# EasyEDA Pro project ProPrj_MOSSE_2026-03-25.epro, schematic Schematic1

## Sheets
1 P1: Board Name: Board1; Create Date: 2026-03-12; Page Name: P1; Project Name: MOSSE; Schematic Name: Schematic1; Update Date: 2026-03-15; Company: EasyEDA.com; Page Size: A4; Version: V1.0
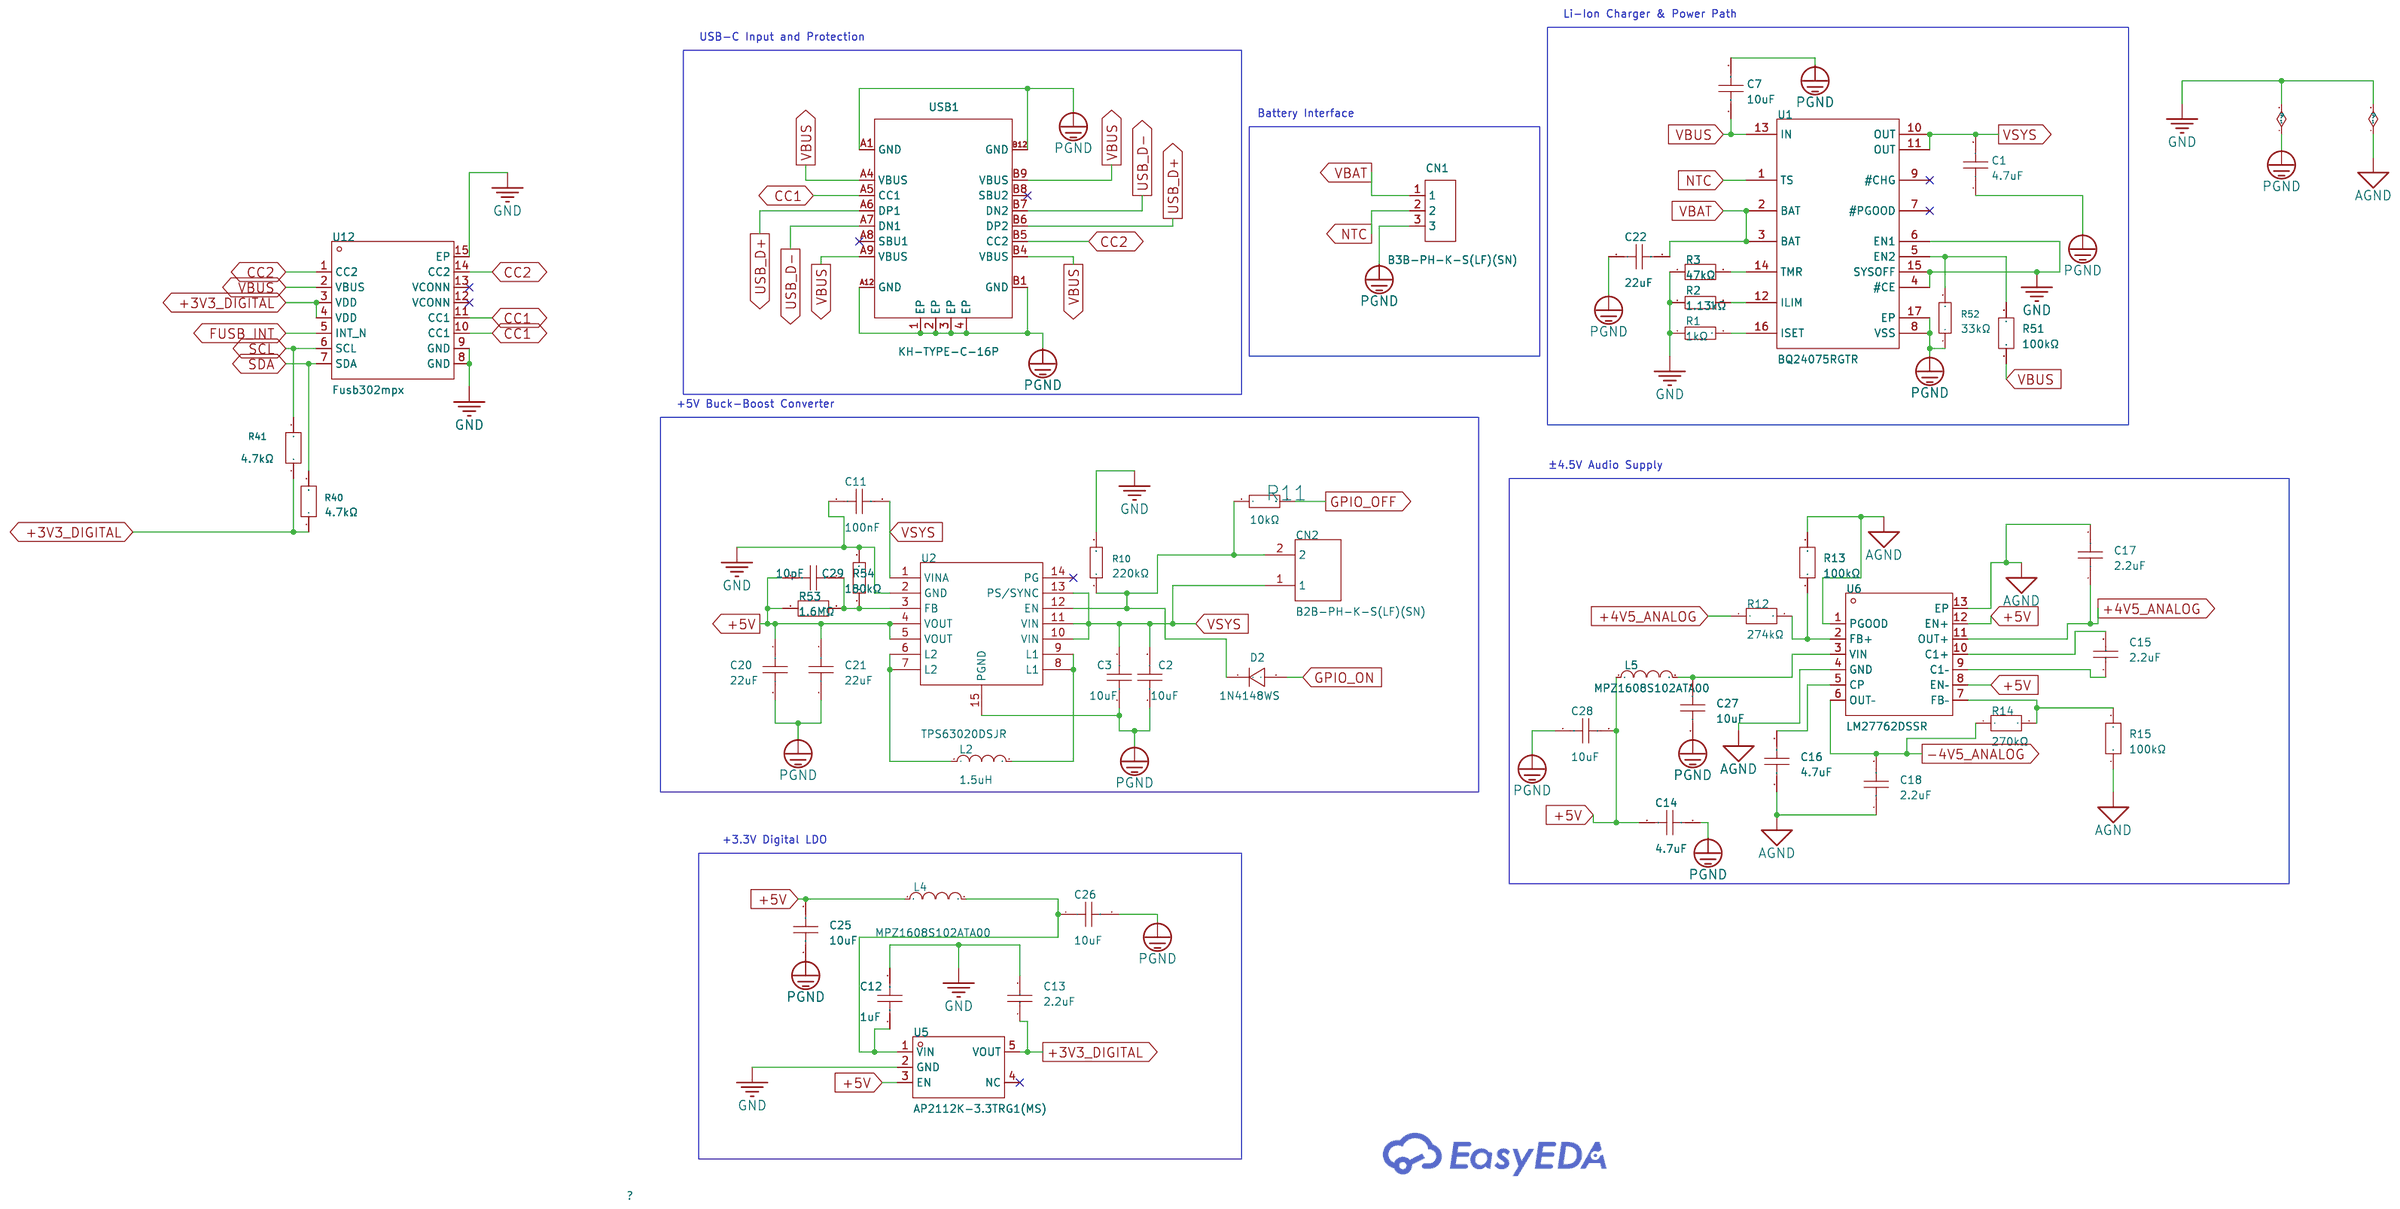
[diagram p0: P1]
2 P3: Create Date: 2026-03-13; Page Name: P3; Update Date: 2026-03-13
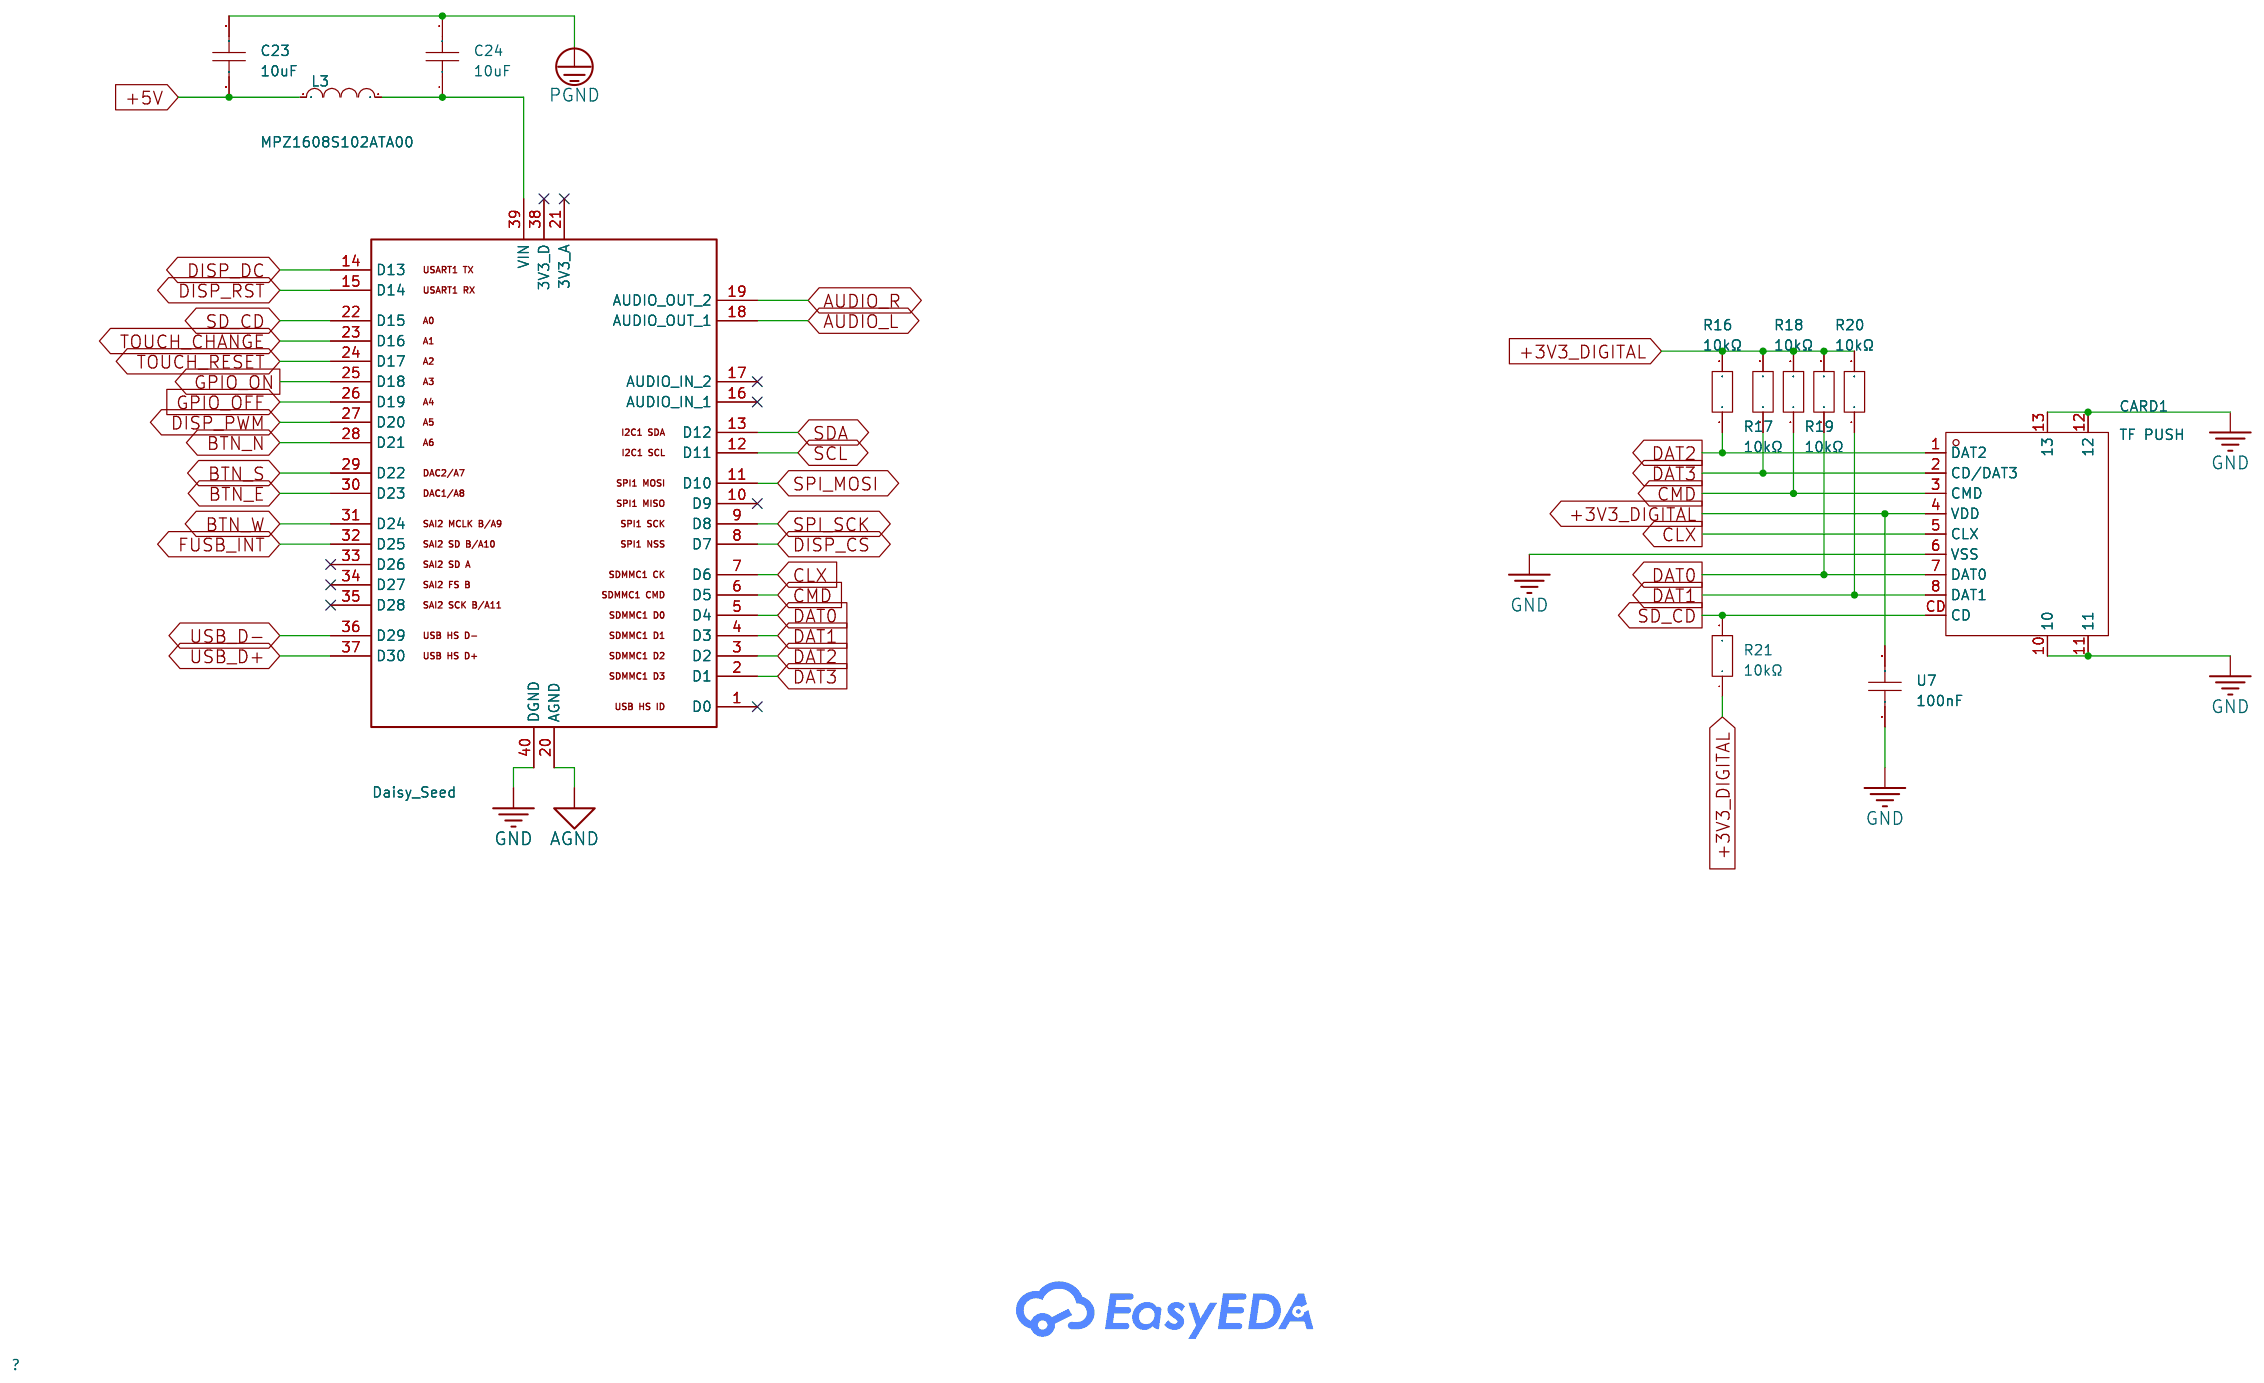
[diagram p1: P3]
3 P4: Create Date: 2026-03-15; Page Name: P4; Update Date: 2026-03-14
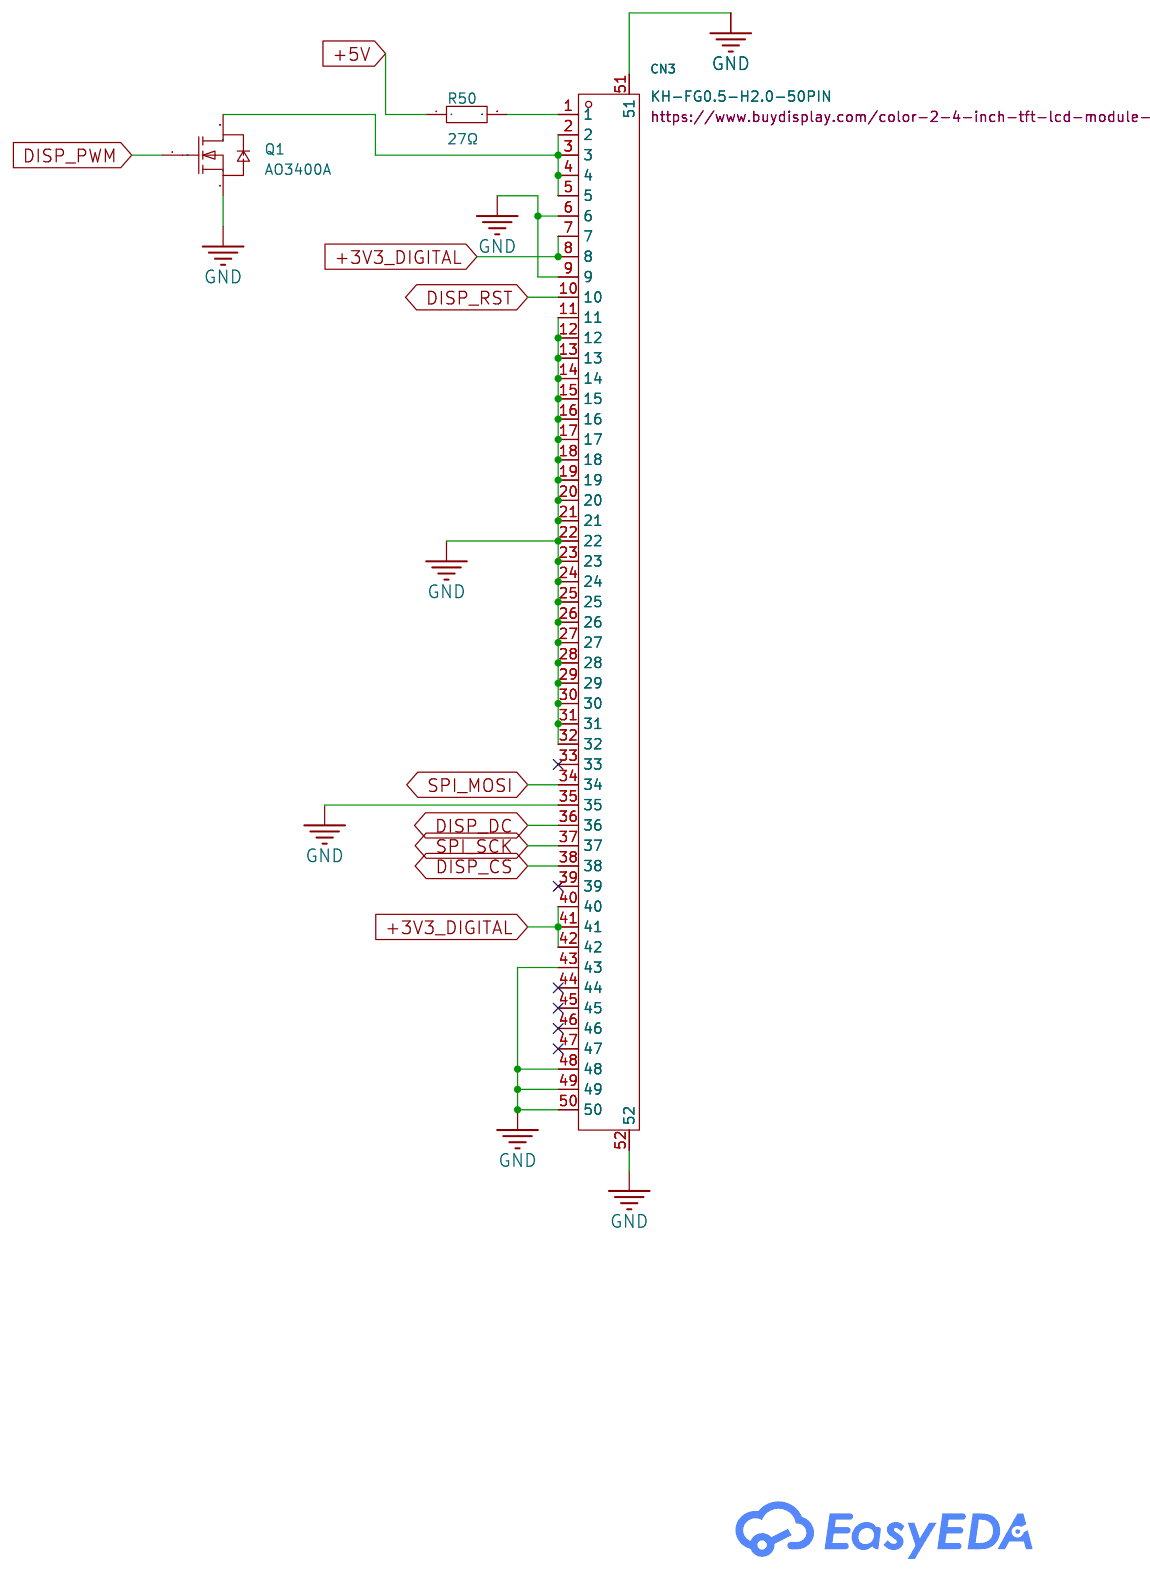
[diagram p2: P4]
4 P5: Create Date: 2026-03-15; Page Name: P5
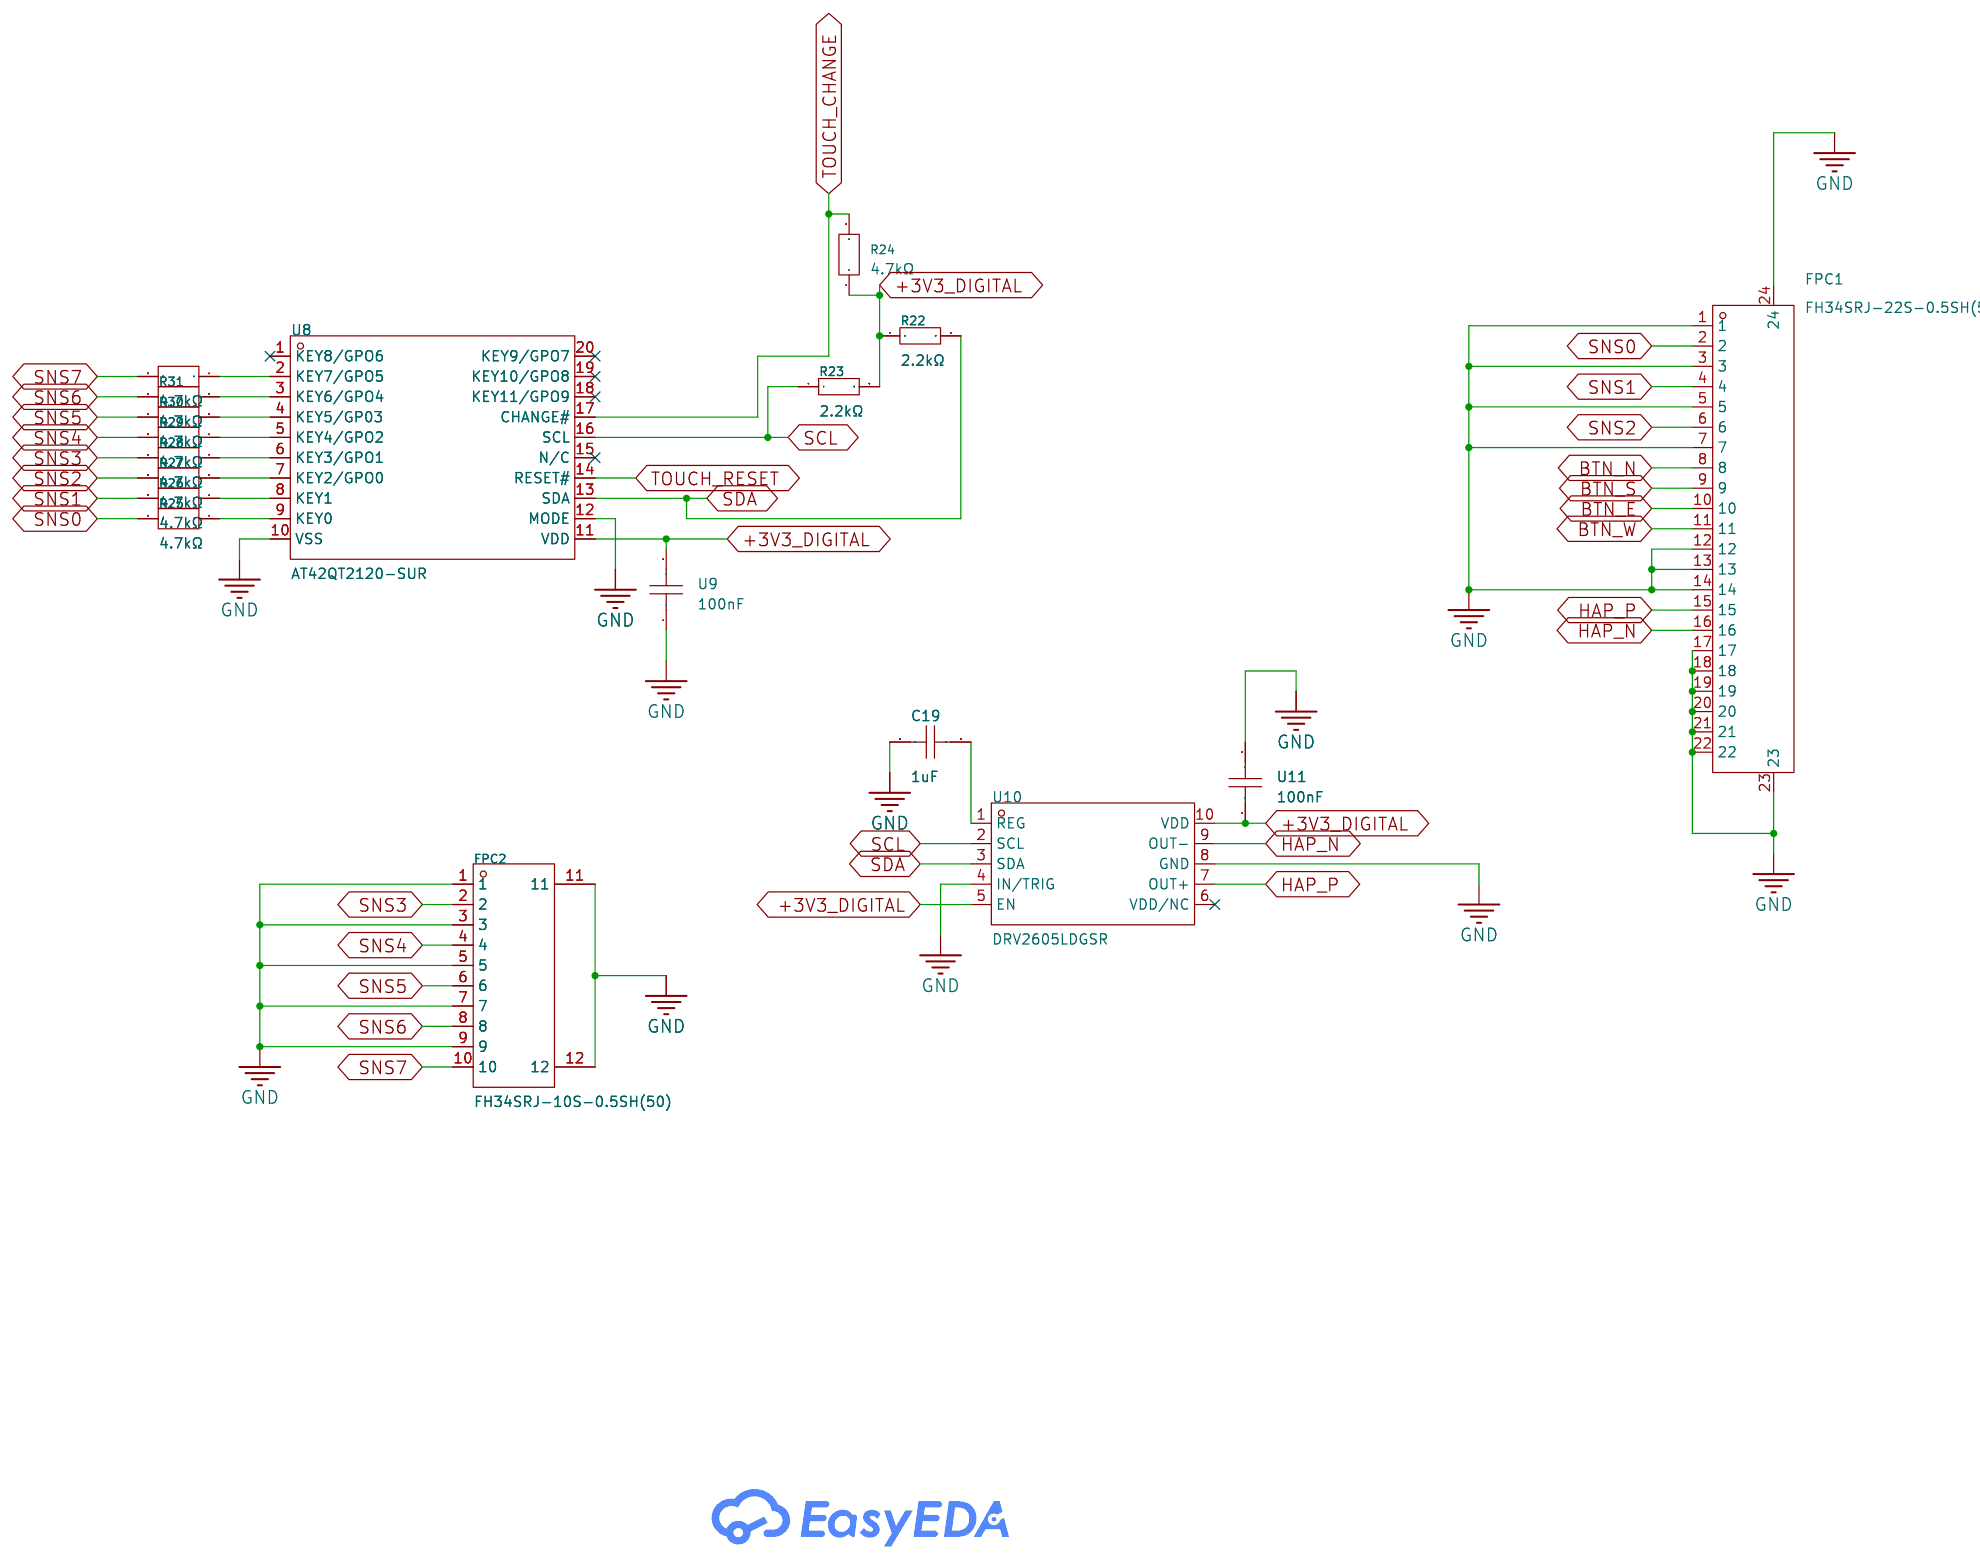
[diagram p3: P5]
5 P6: Create Date: 2026-03-15; Page Name: P6
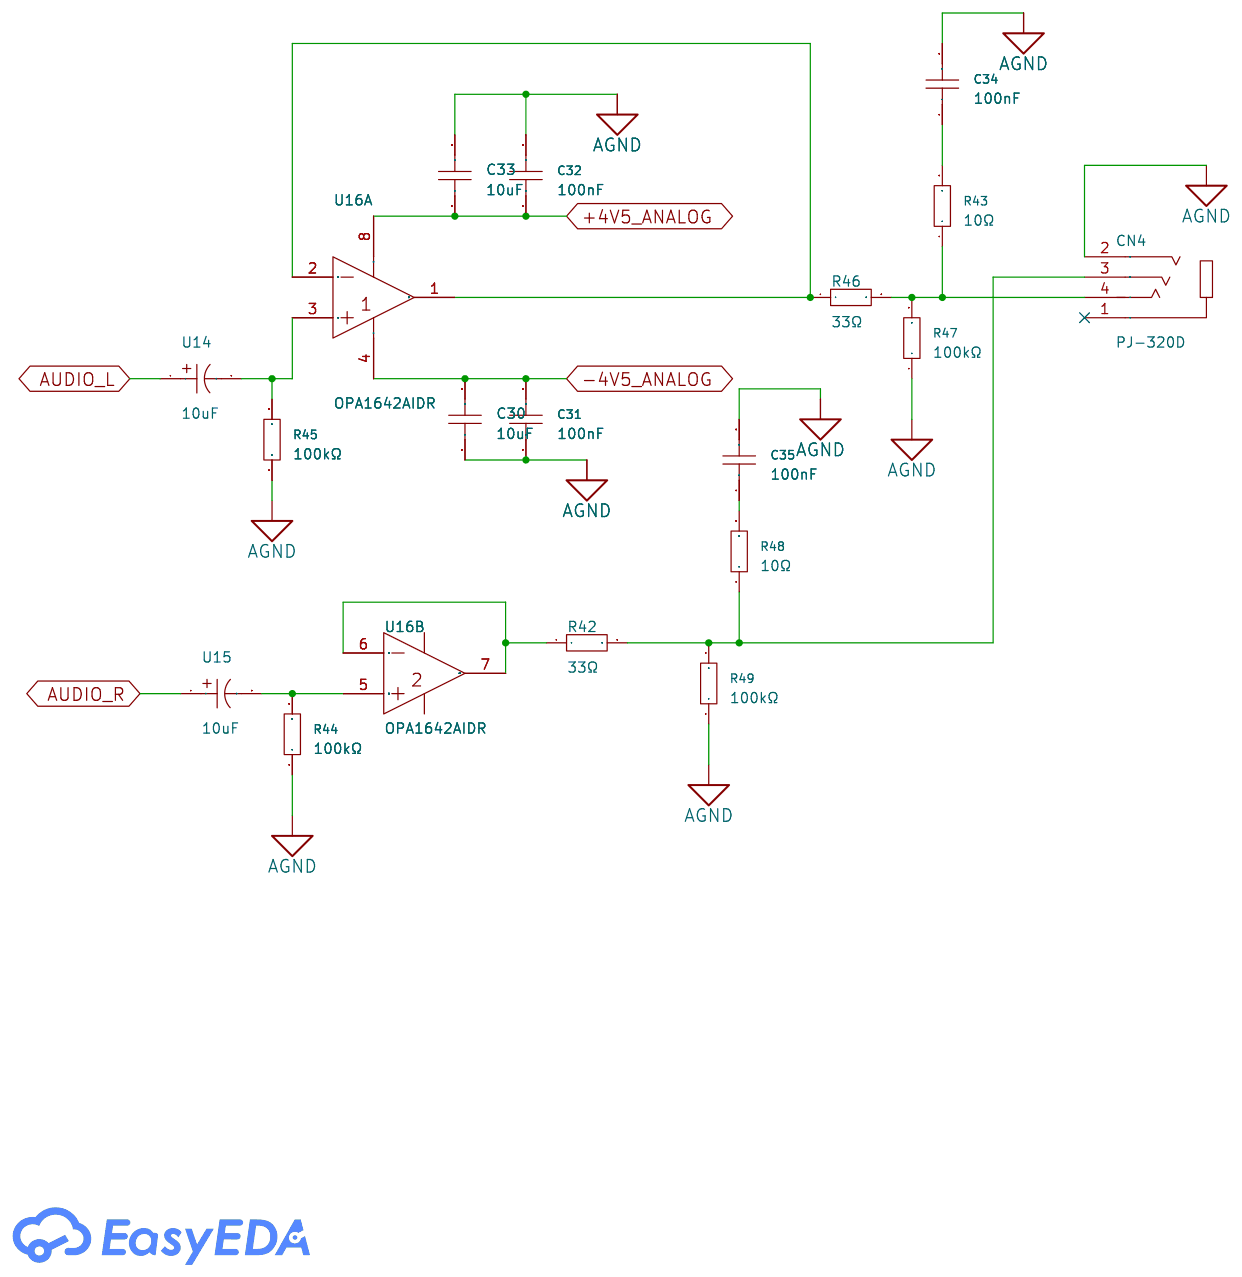
[diagram p4: P6]

## Parts
sheet P1
C1  4.7uF  [C0603]
C2  10uF  [C0603]
C3  10uF  [C0603]
C7  10uF  [C0603]
C11  100nF  [C0603]
C12  1uF  [C0603]
C13  2.2uF  [C0603]
C14  4.7uF  [C0603]
C15  2.2uF  [C0603]
C16  4.7uF  [C0603]
C17  2.2uF  [C0603]
C18  2.2uF  [C0603]
C20  22uF  [C0805]
C21  22uF  [C0805]
C22  22uF  [C0805]
C25  10uF  [C0805]
C26  10uF  [C0805]
C27  10uF  [C0805]
C28  10uF  [C0805]
C29  10pF  [C0603]
CN1  B3B-PH-K-S(LF)(SN)  [CONN-TH_B3B-PH-K-S]
CN2  B2B-PH-K-S(LF)(SN)  [CONN-TH_B2B-PH-K-S]
D2  1N4148WS  [SOD-323_L1.8-W1.3-LS2.5-RD]
L2  1.5uH  [IND-SMD_CYA1040-100UH]
L4  MPZ1608S102ATA00  [L0603]
L5  MPZ1608S102ATA00  [L0603]
R1  1kΩ  [R0603]
R2  1.13kΩ  [R0603]
R3  47kΩ  [R0603]
R10  220kΩ  [R0603]
R11  10kΩ  [R0603]
R12  274kΩ  [R0603]
R13  100kΩ  [R0603]
R14  270kΩ  [R0603]
R15  100kΩ  [R0603]
R40  4.7kΩ  [R0603]
R41  4.7kΩ  [R0603]
R51  100kΩ  [R0805]
R52  33kΩ  [R0805]
R53  1.6MΩ  [R0603]
R54  180kΩ  [R0603]
U1  BQ24075RGTR  [QFN-16_L3.0-W3.0-P0.50-TL-EP1.7]
U2  TPS63020DSJR  [VSON-14_L4.0-W3.0-P0.50-BL-EP_TI_DSJ]
U5  AP2112K-3.3TRG1(MS)  [SOT-23-5_L2.9-W1.6-P0.95-LS2.7-BR]
U6  LM27762DSSR  [WSON-12_L3.0-W2.0-P0.50-BL-EP]
U12  Fusb302mpx  [MLP-14_L2.5-W2.5-P0.50-BL-EP]
USB1  KH-TYPE-C-16P  [USB-C-SMD_KH-TYPE-C-16P]
sheet P3
C23  10uF  [C0805]
C24  10uF  [C0805]
CARD1  TF PUSH  [TF-SMD_TF-PUSH]
L3  MPZ1608S102ATA00  [L0603]
R16  10kΩ  [R0603]
R17  10kΩ  [R0603]
R18  10kΩ  [R0603]
R19  10kΩ  [R0603]
R20  10kΩ  [R0603]
R21  10kΩ  [R0603]
U4  Daisy_Seed  [Daisy_Seed]
U7  100nF  [C0603]
sheet P4
CN3  KH-FG0.5-H2.0-50PIN  [FPC-SMD_KH-FG0.5-H2.0-50PIN]
Q1  AO3400A  [SOT-23-3_L3.0-W1.6-P1.90-LS2.8-BR]
R50  27Ω  [R0805]
sheet P5
C19  1uF  [C0603]
FPC1  FH34SRJ-22S-0.5SH(50)  [FFC-SMD_22P-P0.50_HRS_FH34SRJ-22S-0.5SH]
FPC2  FH34SRJ-10S-0.5SH(50)  [FFC-SMD_10P-P0.50_FH34SRJ-10S-0.5SH]
R22  2.2kΩ  [R0402]
R23  2.2kΩ  [R0402]
R24  4.7kΩ  [R0603]
R25  4.7kΩ  [R0603]
R26  4.7kΩ  [R0603]
R27  4.7kΩ  [R0603]
R28  4.7kΩ  [R0603]
R29  4.7kΩ  [R0603]
R30  4.7kΩ  [R0603]
R31  4.7kΩ  [R0603]
R32  4.7kΩ  [R0603]
U8  AT42QT2120-SUR  [SOIC-20_L12.8-W7.5-P1.27-LS10.3-BL]
U9  100nF  [C0603]
U10  DRV2605LDGSR  [VSSOP-10_L3.0-W3.0-P0.50-LS4.9-BL]
U11  100nF  [C0603]
sheet P6
C30  10uF  [C0805]
C31  100nF  [C0603]
C32  100nF  [C0603]
C33  10uF  [C0805]
C34  100nF  [C0603]
C35  100nF  [C0603]
CN4  PJ-320D  [AUDIO-SMD_PJ-320D-1]
R42  33Ω  [R0603]
R43  10Ω  [R0603]
R44  100kΩ  [R0603]
R45  100kΩ  [R0603]
R46  33Ω  [R0603]
R47  100kΩ  [R0603]
R48  10Ω  [R0603]
R49  100kΩ  [R0603]
U14  10uF  [CAP-SMD_BD4.0-L4.3-W4.3-LS5.0-FD]
U15  10uF  [CAP-SMD_BD4.0-L4.3-W4.3-LS5.0-FD]
U16  OPA1642AIDR  [SOIC-8_L4.9-W3.9-P1.27-LS6.0-BL]  (sections 1,2)

## Library data of the parts
C1 = TCC0603X7R475K160CT: Capacitance:4.7uF Tolerance:±10% Tolerance:±10% Voltage Rating:16V; LCSC Part Name: 4.7uF ±10% 16V; Supplier Part: C48543608; Manufacturer: CCTC(三环); Supplier Footprint: 0603; JLCPCB Part Class: Extended Part; Datasheet: https://item.szlcsc.com/datasheet/TCC0603X7R475K160CT/50806376.html; Supplier: LCSC; Tolerance: ±10%; Voltage Rating: 16V
C2 C3 C7 = 0603X106K100CT: Capacitance:10uF Tolerance:±10% Tolerance:±10% Voltage Rating:- Temperature Coefficient:X5R; LCSC Part Name: 10uF ±10%; Supplier Part: C2840513; Manufacturer: Walsin(华新科); Supplier Footprint: 0603; JLCPCB Part Class: Extended Part; Datasheet: https://item.szlcsc.com/datasheet/0603X106K100CT/3019312.html; Supplier: LCSC; Tolerance: ±10%; Temperature Coefficient: X5R
C11 = CC0603KRX7R9BB104: Capacitance:100nF Tolerance:±10% Tolerance:±10% Voltage Rating:50V Temperature Coefficient:X7R; LCSC Part Name: 100nF ±10% 50V; Supplier Part: C14663; Manufacturer: YAGEO(国巨); Supplier Footprint: 0603; JLCPCB Part Class: Basic Part; Datasheet: https://item.szlcsc.com/datasheet/CC0603KRX7R9BB104/15331.html; Supplier: LCSC; Tolerance: ±10%; Voltage Rating: 50V; Temperature Coefficient: X7R
C12 = CL10A105KB8NNNC: Capacitance:1uF Tolerance:±10% Tolerance:±10% Voltage Rating:50V Temperature Coefficient:X5R; LCSC Part Name: 1uF ±10% 50V; Supplier Part: C15849; Manufacturer: SAMSUNG(三星); Supplier Footprint: 0603; JLCPCB Part Class: Basic Part; Datasheet: https://item.szlcsc.com/datasheet/CL10A105KB8NNNC/16531.html; Supplier: LCSC; Tolerance: ±10%; Voltage Rating: 50V; Temperature Coefficient: X5R
C13 C15 = CL10A225KO8NNNC: Capacitance:2.2uF Tolerance:±10% Tolerance:±10% Voltage Rating:16V Temperature Coefficient:X5R; LCSC Part Name: 2.2uF ±10% 16V; Supplier Part: C23630; Manufacturer: SAMSUNG(三星); Supplier Footprint: 0603; JLCPCB Part Class: Basic Part; Datasheet: https://item.szlcsc.com/datasheet/CL10A225KO8NNNC/24366.html; Supplier: LCSC; Tolerance: ±10%; Voltage Rating: 16V; Temperature Coefficient: X5R
C14 C16 = V475K0603X5R160NDT: Capacitance:4.7uF Voltage Rating:16V Temperature Coefficient:X5R; LCSC Part Name: 4.7uF 16V; Supplier Part: C2980396; Manufacturer: VIIYONG(微容); Supplier Footprint: 0603; JLCPCB Part Class: Extended Part; Datasheet: https://item.szlcsc.com/datasheet/V475K0603X5R160NDT/3402085.html; Supplier: LCSC; Voltage Rating: 16V; Temperature Coefficient: X5R
C17 C18 = 0603X225M160NT: Capacitance:2.2uF Tolerance:±20% Tolerance:±20% Voltage Rating:16V; LCSC Part Name: 2.2uF ±20% 16V; Supplier Part: C50331154; Manufacturer: FH(风华); Supplier Footprint: 0603; JLCPCB Part Class: Extended Part; Datasheet: https://item.szlcsc.com/datasheet/0603X225M160NT/52930819.html; Supplier: LCSC; Tolerance: ±20%; Voltage Rating: 16V
C20-C22 = 0805X226M160NT: Capacitance:22uF Tolerance:±20% Tolerance:±20% Voltage Rating:16V Temperature Coefficient:X5R; LCSC Part Name: 22uF ±20% 16V; Supplier Part: C129302; Manufacturer: FH(风华); Supplier Footprint: 0805; JLCPCB Part Class: Extended Part; Datasheet: https://item.szlcsc.com/datasheet/0805X226M160NT/140588.html; Supplier: LCSC; Tolerance: ±20%; Voltage Rating: 16V; Temperature Coefficient: X5R
C23-C28 C30 C33 = 0805B106K160NT: Capacitance:10uF Tolerance:±10% Tolerance:±10% Voltage Rating:16V Temperature Coefficient:X7R; LCSC Part Name: 10uF ±10% 16V; Supplier Part: C92341; Manufacturer: FH(风华); Supplier Footprint: 0805; JLCPCB Part Class: Extended Part; Datasheet: https://item.szlcsc.com/datasheet/0805B106K160NT/93534.html; Supplier: LCSC; Tolerance: ±10%; Voltage Rating: 16V; Temperature Coefficient: X7R
C29 = 0603N100D500CT: Capacitance:10pF Voltage Rating:50V Temperature Coefficient:NP0; LCSC Part Name: ±0.5pF 10pF 50V; Supplier Part: C296044; Manufacturer: Walsin(华新科); Supplier Footprint: 0603; JLCPCB Part Class: Extended Part; Datasheet: https://item.szlcsc.com/datasheet/0603N100D500CT/280464.html; Supplier: LCSC; Voltage Rating: 50V; Temperature Coefficient: NP0
CN1 = B3B-PH-K-S(LF)(SN): Pins Structure:1x3P Pitch:2mm Mounting Type:Through Hole Reference Series:PH Number of Pins:3P Number of Rows:1 Number of PINs Per Row:3 Row Spacing:- Current Rating:2A Contact Material:Brass Contact Plating:Tin Operating Temperature:-25℃~+85℃ Operating T; LCSC Part Name: 1x3P 间距:2mm 直插 系列:PH; Supplier Part: C131339; Manufacturer: JST; Supplier Footprint: 插件,P=2mm; JLCPCB Part Class: Extended Part; Datasheet: https://item.szlcsc.com/datasheet/B3B-PH-K-S(LF)(SN)/142632.html; Supplier: LCSC; Pins Structure: 1x3P; Pitch: 2mm; Mounting Type: Through Hole; Reference Series: PH; Number of Pins: 3P; Number of Rows: 1; Number of PINs Per Row: 3; Current Rating: 2A; Contact Material: Brass; Contact Plating: Tin; Operating Temperature: -25℃~+85℃; Voltage Rating: 100V; Plastic Material: PA66; Flame Retardant Rating: UL94V-0; Supplementary Features: K Pin; Color: White; Z-Height of the Board: 6mm; X-Length of Bottom Edge on Board (Spacing Line): 7.9mm; Y-Width of Bottom Edge on Board: 4.5mm
CN2 = B2B-PH-K-S(LF)(SN): Pins Structure:1x2P Pitch:2mm Mounting Type:Through Hole Reference Series:PH Number of Pins:2P Number of Rows:1 Number of PINs Per Row:2 Row Spacing:- Current Rating:2A Contact Material:Brass Contact Plating:Tin Operating Temperature:-25℃~+85℃ Operating T; LCSC Part Name: 1x2P 间距:2mm 直插 系列:PH; Supplier Part: C131337; Manufacturer: JST; Supplier Footprint: 插件,P=2mm; JLCPCB Part Class: Extended Part; Datasheet: https://item.szlcsc.com/datasheet/B2B-PH-K-S(LF)(SN)/142630.html; Supplier: LCSC; Pins Structure: 1x2P; Pitch: 2mm; Mounting Type: Through Hole; Reference Series: PH; Number of Pins: 2P; Number of Rows: 1; Number of PINs Per Row: 2; Current Rating: 2A; Contact Material: Brass; Contact Plating: Tin; Operating Temperature: -25℃~+85℃; Voltage Rating: 100V; Plastic Material: PA66; Flame Retardant Rating: UL94V-0; Supplementary Features: K Pin; Color: White; Z-Height of the Board: 6mm; X-Length of Bottom Edge on Board (Spacing Line): 5.9mm; Y-Width of Bottom Edge on Board: 4.5mm
D2 = 1N4148WS_C2128: Diode Configuration:Independent Voltage - Forward(Vf@If):1.25V@150mA Voltage - DC Reverse(Vr):100V Current - Rectified:150mA Pd - Power Dissipation:200mW Reverse Leakage Current (Ir):1uA@75V Reverse Recovery Time (trr):4ns Operating Junction Temperature R; LCSC Part Name: 丝印T4 1N4148WS; Supplier Part: C2128; Manufacturer: CJ(江苏长电/长晶); Supplier Footprint: SOD-323; JLCPCB Part Class: Basic Part; Datasheet: https://item.szlcsc.com/datasheet/1N4148WS/2485.html; Supplier: LCSC; Diode Configuration: Independent; Voltage - Forward(Vf@If): 1.25V@150mA; Voltage - DC Reverse(Vr): 100V; Current - Rectified: 150mA; Pd - Power Dissipation: 200mW; Reverse Leakage Current (Ir): 1uA@75V; Reverse Recovery Time (trr): 4ns; Non-Repetitive Peak Forward Surge Current: 2A
L2 = CYA1040-1.5UH: Inductance:1.5uH Tolerance:±20% Tolerance:±20% Current Rating:16A Current - Saturation (Isat):22A DC Resistance(DCR):3.8mΩ; LCSC Part Name: 1.5uH ±20% 22A; Supplier Part: C6364672; Manufacturer: SHOU HAN(首韩); Supplier Footprint: SMD,11.6x10.1mm; JLCPCB Part Class: Extended Part; Datasheet: https://item.szlcsc.com/datasheet/CYA1040-1.5UH/7314074.html; Supplier: LCSC; Tolerance: ±20%; Current Rating: 16A; Current - Saturation (Isat): 22A; DC Resistance(DCR): 3.8mΩ
L3-L5 = MPZ1608S102ATA00: Impedance @ Frequency:1kΩ@100MHz Tolerance:±25% Tolerance:±25% DC Resistance:300mΩ Current Rating:800mA Circuits:1; LCSC Part Name: 单路 0603磁珠 阻抗1kΩ@100MHz; Supplier Part: C76814; Manufacturer: TDK; Supplier Footprint: 0603; JLCPCB Part Class: Extended Part; Datasheet: https://atta.szlcsc.com/upload/public/pdf/source/20170420/1492670791787.pdf; Supplier: LCSC; Impedance @ Frequency: 1kΩ@100MHz; Tolerance: ±25%; DC Resistance: 300mΩ; Current Rating: 800mA; Circuits: 1
R1 = 0603WAF1001T5E: Type:Thick Film Resistor Resistance:1kΩ Tolerance:±1% Tolerance:±1% Power(Watts):100mW Voltage-Supply(Max):75V Temperature Coefficient:±100ppm/℃ Temperature Coefficient:±100ppm/℃ Operating Temperature:-55℃~+155℃ Operating Temperature:-55℃~+155℃; LCSC Part Name: 1kΩ ±1% 100mW 厚膜电阻; Supplier Part: C21190; Manufacturer: UNI-ROYAL(厚声); Supplier Footprint: 0603; JLCPCB Part Class: Basic Part; Datasheet: https://item.szlcsc.com/datasheet/0603WAF1001T5E/21904.html; Supplier: LCSC; Type: Thick Film Resistor; Tolerance: ±1%; Power(Watts): 100mW; Voltage-Supply(Max): 75V; Temperature Coefficient: ±100ppm/℃; Operating Temperature: -55℃~+155℃
R2 = 0603WAF1131T5E: Type:Thick Film Resistor Resistance:1.13kΩ Tolerance:±1% Tolerance:±1% Power(Watts):100mW Voltage-Supply(Max):75V Temperature Coefficient:±100ppm/℃ Temperature Coefficient:±100ppm/℃ Operating Temperature:-55℃~+155℃ Operating Temperature:-55℃~+155℃; LCSC Part Name: 1.13kΩ ±1% 100mW 厚膜电阻; Supplier Part: C22833; Manufacturer: UNI-ROYAL(厚声); Supplier Footprint: 0603; JLCPCB Part Class: Extended Part; Datasheet: https://item.szlcsc.com/datasheet/0603WAF1131T5E/23560.html; Supplier: LCSC; Type: Thick Film Resistor; Tolerance: ±1%; Power(Watts): 100mW; Voltage-Supply(Max): 75V; Temperature Coefficient: ±100ppm/℃; Operating Temperature: -55℃~+155℃
R3 = SCR0603J47K: Type:Thick Film Resistors Resistance: Tolerance:±5% Tolerance:±5% Power(Watts): Overload Voltage (Max): Operating Temperature Range:-55℃~+155℃ Operating Temperature Range:-55℃~+155℃; LCSC Part Name: 厚膜电阻 47kΩ ±5% 100mW; Supplier Part: C3017699; Manufacturer: VO(翔胜); Supplier Footprint: 0603; JLCPCB Part Class: Extended Part; Datasheet: https://atta.szlcsc.com/upload/public/pdf/source/20220513/247AF9639BA21CF93567DC289CCC6A22.pdf; Supplier: LCSC; Type: Thick Film Resistors; Tolerance: ±5%; Operating Temperature Range: -55℃~+155℃
R10 = 0603WAF2203T5E: Type:Thick Film Resistor Resistance:220kΩ Tolerance:±1% Tolerance:±1% Power(Watts):100mW Voltage-Supply(Max):75V Temperature Coefficient:±100ppm/℃ Temperature Coefficient:±100ppm/℃ Operating Temperature:-55℃~+155℃ Operating Temperature:-55℃~+155℃; LCSC Part Name: 220kΩ ±1% 100mW 厚膜电阻; Supplier Part: C22961; Manufacturer: UNI-ROYAL(厚声); Supplier Footprint: 0603; JLCPCB Part Class: Basic Part; Datasheet: https://item.szlcsc.com/datasheet/0603WAF2203T5E/23688.html; Supplier: LCSC; Type: Thick Film Resistor; Tolerance: ±1%; Power(Watts): 100mW; Voltage-Supply(Max): 75V; Temperature Coefficient: ±100ppm/℃; Operating Temperature: -55℃~+155℃
R11 = 0603WAF1002T5E: Type:Thick Film Resistor Resistance:10kΩ Tolerance:±1% Tolerance:±1% Power(Watts):100mW Voltage-Supply(Max):75V Temperature Coefficient:±100ppm/℃ Temperature Coefficient:±100ppm/℃ Operating Temperature:-55℃~+155℃ Operating Temperature:-55℃~+155℃; LCSC Part Name: 厚膜电阻 10kΩ ±1% 100mW; Supplier Part: C25804; Manufacturer: UNI-ROYAL(厚声); Supplier Footprint: 0603; JLCPCB Part Class: Basic Part; Datasheet: https://item.szlcsc.com/datasheet/0603WAF1002T5E/26547.html; Supplier: LCSC; Type: Thick Film Resistor; Tolerance: ±1%; Power(Watts): 100mW; Voltage-Supply(Max): 75V; Temperature Coefficient: ±100ppm/℃; Operating Temperature: -55℃~+155℃
R12 = RT0603BRE07274KL: Type:Thin Film Resistor Resistance: Tolerance:±0.1% Tolerance:±0.1% Power(Watts): Overload Voltage (Max): Temperature Coefficient:±50ppm/℃ Temperature Coefficient:±50ppm/℃ Operating Temperature Range:-55℃~+155℃ Operating Temperature Range:-55℃~+155℃; LCSC Part Name: 薄膜电阻 274kΩ ±0.1% 100mW; Supplier Part: C705837; Manufacturer: YAGEO(国巨); Supplier Footprint: 0603; JLCPCB Part Class: Extended Part; Datasheet: https://atta.szlcsc.com/upload/public/pdf/source/20200720/C705837_DD76269E46E9F80C027ECD7C537EEFB5.pdf; Supplier: LCSC; Type: Thin Film Resistor; Tolerance: ±0.1%; Temperature Coefficient: ±50ppm/℃; Operating Temperature Range: -55℃~+155℃
R13 R15 = FCR0603F100K: Type:Thick Film Resistors Resistance: Tolerance:±1% Tolerance:±1% Power(Watts): Overload Voltage (Max): Operating Temperature Range:-55℃~+155℃ Operating Temperature Range:-55℃~+155℃; LCSC Part Name: 100K ±1%; Supplier Part: C5913165; Manufacturer: VO(翔胜); Supplier Footprint: 0603; JLCPCB Part Class: Extended Part; Datasheet: https://atta.szlcsc.com/upload/public/pdf/source/20230428/98B65D379E9BA4CF2A9223D1647B01B6.pdf; Supplier: LCSC; Type: Thick Film Resistors; Tolerance: ±1%; Operating Temperature Range: -55℃~+155℃
R14 = PTFR0603B270KN9: Type:Thin Film Resistor Resistance:270kΩ Tolerance:±0.1% Tolerance:±0.1% Power(Watts):100mW Voltage-Supply(Max):100V Temperature Coefficient:±10ppm/℃ Temperature Coefficient:±10ppm/℃ Operating Temperature:-55℃~+155℃ Operating Temperature:-55℃~+155℃; LCSC Part Name: 薄膜电阻 270kΩ ±0.1% 100mW; Supplier Part: C19680171; Manufacturer: RESI(开步睿思); Supplier Footprint: 0603; JLCPCB Part Class: Extended Part; Datasheet: https://item.szlcsc.com/datasheet/PTFR0603B270KN9/20987648.html; Supplier: LCSC; Type: Thin Film Resistor; Tolerance: ±0.1%; Power(Watts): 100mW; Voltage-Supply(Max): 100V; Temperature Coefficient: ±10ppm/℃; Operating Temperature: -55℃~+155℃
R24-R32 R40 R41 = HoLTT0603-1/10W-4.7K-1%: Type:Thick Film Resistor Resistance:4.7kΩ Tolerance:±1% Tolerance:±1% Power(Watts):100mW Voltage-Supply(Max):75V Temperature Coefficient:±100ppm/℃ Temperature Coefficient:±100ppm/℃ Operating Temperature:-55℃~+155℃ Operating Temperature:-55℃~+155℃; LCSC Part Name: 4.7kΩ ±1% 100mW; Supplier Part: C2904521; Manufacturer: Milliohm(毫欧); Supplier Footprint: 0603; JLCPCB Part Class: Extended Part; Datasheet: https://item.szlcsc.com/datasheet/HoLTT0603-1%252F10W-4.7K-1%2525/3164221.html; Supplier: LCSC; Type: Thick Film Resistor; Tolerance: ±1%; Power(Watts): 100mW; Voltage-Supply(Max): 75V; Temperature Coefficient: ±100ppm/℃; Operating Temperature: -55℃~+155℃
R51 = SCR0805J100K: Type:Thick Film Resistors Resistance: Tolerance:±5% Tolerance:±5% Power(Watts): Overload Voltage (Max): Operating Temperature Range:-55℃~+155℃ Operating Temperature Range:-55℃~+155℃; LCSC Part Name: 厚膜电阻 100kΩ ±5% 125mW; Supplier Part: C3017875; Manufacturer: VO(翔胜); Supplier Footprint: 0805; JLCPCB Part Class: Extended Part; Datasheet: https://atta.szlcsc.com/upload/public/pdf/source/20220513/247AF9639BA21CF93567DC289CCC6A22.pdf; Supplier: LCSC; Type: Thick Film Resistors; Tolerance: ±5%; Operating Temperature Range: -55℃~+155℃
R52 = RMC080533K1%N: Type:Thick Film Resistor Resistance:33kΩ Tolerance:±1% Tolerance:±1% Power(Watts):125mW Voltage-Supply(Max):150V Temperature Coefficient:±100ppm/℃ Temperature Coefficient:±100ppm/℃ Operating Temperature:-55℃~+155℃ Operating Temperature:-55℃~+155℃; LCSC Part Name: 厚膜电阻 33kΩ ±1% 125mW; Supplier Part: C269540; Manufacturer: Tyohm(幸亚电阻); Supplier Footprint: 0805; JLCPCB Part Class: Extended Part; Datasheet: https://item.szlcsc.com/datasheet/RMC080533K1%2525N/258980.html; Supplier: LCSC; Type: Thick Film Resistor; Tolerance: ±1%; Power(Watts): 125mW; Voltage-Supply(Max): 150V; Temperature Coefficient: ±100ppm/℃; Operating Temperature: -55℃~+155℃
R53 = FRC0603F1604TS: Type:Thick Film Resistor Resistance:1.6MΩ Tolerance:±1% Tolerance:±1% Power(Watts):100mW Voltage-Supply(Max):75V Temperature Coefficient:±100ppm/℃ Temperature Coefficient:±100ppm/℃ Operating Temperature:-55℃~+155℃ Operating Temperature:-55℃~+155℃; LCSC Part Name: 1.6MΩ ±1% 100mW 厚膜电阻; Supplier Part: C2999520; Manufacturer: FOJAN(富捷); Supplier Footprint: 0603; JLCPCB Part Class: Extended Part; Supplier: LCSC; Type: Thick Film Resistor; Tolerance: ±1%; Power(Watts): 100mW; Voltage-Supply(Max): 75V; Temperature Coefficient: ±100ppm/℃; Operating Temperature: -55℃~+155℃
R54 = CR0603JA0184G: Type:Thick Film Resistor Resistance:180kΩ Tolerance:±5% Tolerance:±5% Power(Watts):100mW Voltage-Supply(Max):50V Temperature Coefficient:±200ppm/℃ Temperature Coefficient:±200ppm/℃ Operating Temperature:-55℃~+125℃ Operating Temperature:-55℃~+125℃; LCSC Part Name: 厚膜电阻 180kΩ ±5% 100mW; Supplier Part: C101287; Manufacturer: LIZ(丽智电子); Supplier Footprint: 0603; JLCPCB Part Class: Extended Part; Datasheet: https://item.szlcsc.com/datasheet/CR0603JA0184G/102502.html; Supplier: LCSC; Type: Thick Film Resistor; Tolerance: ±5%; Power(Watts): 100mW; Voltage-Supply(Max): 50V; Temperature Coefficient: ±200ppm/℃; Operating Temperature: -55℃~+125℃
U1 = BQ24075RGTR: The Chip Type:Charging IC Voltage - Supply:4.35V~6.4V Voltage - Supply:4.35V~6.4V Charge Current - Max:1.5A Charging Saturation Voltage:4.2V Type of Battery:Lithium Battery Number of Cells:- Number of Cells:- Operating Temperature:-40℃~+125℃ Operating Tem; LCSC Part Name: 1.5A USB友好型锂离子电池充电器和电源路径管理IC; Supplier Part: C15464; Manufacturer: TI(德州仪器); Supplier Footprint: QFN-16-EP(3x3); JLCPCB Part Class: Extended Part; Datasheet: http://www.ti.com/cn/lit/gpn/bq24075; Supplier: LCSC; The Chip Type: Charging IC; Voltage - Supply: 4.35V~6.4V; Charge Current - Max: 1.5A; Charging Saturation Voltage: 4.2V; Type of Battery: Lithium Battery; Operating Temperature: -40℃~+125℃; Battery Temperature Detection: Support; 0V Battery Charge: Not supported; Supply Current (Iq): 6.5uA
U2 = TPS63020DSJR: Function:Boost type Output Type:Adjustable Voltage - Supply:1.8V~5.5V Voltage - Supply:1.8V~5.5V Output Voltage:1.2V~5.5V Output Voltage:1.2V~5.5V Output Current:3A Frequency - Switching:2.4MHz Frequency - Switching:2.4MHz Operating Temperature:-40℃~+85℃@; LCSC Part Name: 高效率单电感升降压转换器; Supplier Part: C15483; Manufacturer: TI(德州仪器); Supplier Footprint: VSON-14-EP(3x4); JLCPCB Part Class: Extended Part; Datasheet: https://www.ti.com/cn/lit/gpn/tps63020; Supplier: LCSC; Function: Boost type; Output Type: Adjustable; Voltage - Supply: 1.8V~5.5V; Output Voltage: 1.2V~5.5V; Output Current: 3A; Frequency - Switching: 2.4MHz; Operating Temperature: -40℃~+85℃@(TA); Synchronous Rectifier: Yes; Number of Outputs: 1; Topology: Step-down-Boost; Quiescent Current: 50uA; Switch tube (built-in/external): Built-in
U5 = AP2112K-3.3TRG1(MS): Output Type:Fixed Voltage - Supply:6V Output Voltage:3.3V Output Voltage:3.3V Output Current:600mA Power Supply Rejection Ratio (PSRR):75dB@(1kHz) Voltage Dropout:- standby current:2uA Noise:- Features:Automatic Discharge Function；Low ESR；Overheat protect; Supplier Part: C22365427; Manufacturer: MSKSEMI(美森科); Supplier Footprint: SOT-23-5; JLCPCB Part Class: Extended Part; Datasheet: https://item.szlcsc.com/datasheet/AP2112K-3.3TRG1(MS)/23832169.html; Supplier: LCSC; Output Type: Fixed; Voltage - Supply: 6V; Output Voltage: 3.3V; Output Current: 600mA; Power Supply Rejection Ratio (PSRR): 75dB@(1kHz); standby current: 2uA; Features: Automatic Discharge Function；Low ESR；Overheat protection；Overcurrent Protection；With ability; Operating Temperature: -40℃~+125℃@(Tj); Output Configuration: Positive electrode; Number of Outputs: 1
U6 = LM27762DSSR: LCSC Part Name: 低噪声正负输出集成电荷泵加LDO; Supplier Part: C473398; Manufacturer: TI(德州仪器); Supplier Footprint: WSON-12-EP(2x3); JLCPCB Part Class: Extended Part; Datasheet: https://www.ti.com/cn/lit/gpn/lm27762; Supplier: LCSC
U12 = Fusb302mpx: Applications Function:Controller Protocol:- Voltage - Supply:2.8V~5.5V Voltage - Supply:2.8V~5.5V Operating Temperature:-40℃~+85℃ Operating Temperature:-40℃~+85℃; LCSC Part Name: 可编程USB Type-C控制器带PD功能; Supplier Part: C442699; Manufacturer: onsemi(安森美); Supplier Footprint: WFQFN-14(2.5x2.5); JLCPCB Part Class: Extended Part; Datasheet: https://item.szlcsc.com/datasheet/Fusb302mpx/444112.html; Supplier: LCSC; Applications Function: Controller; Voltage - Supply: 2.8V~5.5V; Operating Temperature: -40℃~+85℃
USB1 = KH-TYPE-C-16P: Connector Type:Type-C Protocol Standard:- Gender:Female Mounting Type:Surface Mount, Right Angle Number of Contacts:16P Number of Ports:1 Current Rating-Power:3A Voltage Rating:30V Connect-Disconnect Life:10,000 cycles Length:7.81mm Operating Temperature:; LCSC Part Name: Type-C 母 卧贴; Supplier Part: C709357; Manufacturer: kinghelm(金航标); Supplier Footprint: SMD; JLCPCB Part Class: Extended Part; Datasheet: https://item.szlcsc.com/datasheet/KH-TYPE-C-16P/747093.html; Supplier: LCSC; Connector Type: Type-C; Gender: Female; Mounting Type: Surface Mount, Right Angle; Number of Contacts: 16P; Number of Ports: 1; Current Rating-Power: 3A; Voltage Rating: 30V; Connect-Disconnect Life: 10,000 cycles; Length: 7.81mm; Operating Temperature: -40℃~+85℃
CARD1 = TF PUSH: Card Connection Mode:Push-Push Card Type:MicroSD Card (TF Card) Connector Type:Connector and Ejector Additional Card Detection Pins:No Supplementary Features:- Height Above Board:2mm Operating Temperature:-25℃~+90℃ Operating Temperature:-25℃~+90℃; LCSC Part Name: 9P，自弹式TF卡座; Supplier Part: C393941; Manufacturer: SHOU HAN(首韩); Supplier Footprint: SMD; JLCPCB Part Class: Extended Part; Datasheet: https://item.szlcsc.com/datasheet/TF%2520PUSH/372553.html; Supplier: LCSC; Card Connection Mode: Push-Push; Card Type: MicroSD Card (TF Card); Connector Type: Connector and Ejector; Additional Card Detection Pins: No; Height Above Board: 2mm; Operating Temperature: -25℃~+90℃
R16-R21 = SCR0603J10K: Type:Thick Film Resistors Resistance: Tolerance:±5% Tolerance:±5% Power(Watts): Overload Voltage (Max): Operating Temperature Range:-55℃~+155℃ Operating Temperature Range:-55℃~+155℃; LCSC Part Name: 厚膜电阻 10kΩ ±5% 100mW; Supplier Part: C3017715; Manufacturer: VO(翔胜); Supplier Footprint: 0603; JLCPCB Part Class: Extended Part; Datasheet: https://atta.szlcsc.com/upload/public/pdf/source/20220513/247AF9639BA21CF93567DC289CCC6A22.pdf; Supplier: LCSC; Type: Thick Film Resistors; Tolerance: ±5%; Operating Temperature Range: -55℃~+155℃
U4 = Daisy_Seed
U7 U9 U11 = C0603X104M5RACTU: Capacitance:100nF Tolerance:±20% Tolerance:±20% Voltage Rating:50V; LCSC Part Name: 100nF ±20% 50V; Supplier Part: C23481007; Manufacturer: KEMET(基美); Supplier Footprint: 0603; Datasheet: https://item.szlcsc.com/datasheet/C0603X104M5RACTU/25209910.html; Supplier: LCSC; Tolerance: ±20%; Voltage Rating: 50V
CN3 = KH-FG0.5-H2.0-50PIN: Locking Feature:Hinged Lid Contact Type:Bottom Contact Number of Contacts:50P Pitch:0.5mm Mounting Type:Surface Mount, Right Angle FFC, FCB Thickness:0.3mm FFC, FCB Thickness:0.3mm Height Above Board:2mm Operating Temperature:-25℃~+85℃ Operating Temperatu; LCSC Part Name: 间距:0.5mm P数:50P 翻盖式 下接; Supplier Part: C2797221; Manufacturer: kinghelm(金航标); Supplier Footprint: SMD,P=0.5mm,卧贴; JLCPCB Part Class: Extended Part; Datasheet: https://item.szlcsc.com/datasheet/KH-FG0.5-H2.0-50PIN/2935753.html; Supplier: LCSC; Locking Feature: Hinged Lid; Contact Type: Bottom Contact; Number of Contacts: 50P; Pitch: 0.5mm; Mounting Type: Surface Mount, Right Angle; FFC, FCB Thickness: 0.3mm; Height Above Board: 2mm; Operating Temperature: -25℃~+85℃; Product Link: https://www.buydisplay.com/color-2-4-inch-tft-lcd-module-display-touch-panel-240x320-dot-serial-spi
Q1 = AO3400A_C5224194: Number:One N-channel Drain to Source Voltage:30V Current - Continuous Drain(Id):5.8A RDS(on):21mΩ@10V Pd - Power Dissipation:1.4W Gate Threshold Voltage (Vgs(th)):1V@250uA Gate Charge(Qg):6.7nC@4.5V Input Capacitance(Ciss):550pF Reverse Transfer Capacitan; LCSC Part Name: N沟道,电流:5.8A,耐压:30V; Supplier Part: C5224194; Manufacturer: ElecSuper(静芯); Supplier Footprint: SOT23-3L; JLCPCB Part Class: Extended Part; Datasheet: https://item.szlcsc.com/datasheet/AO3400A/5925703.html; Supplier: LCSC; Number: One N-channel; Drain to Source Voltage: 30V; Current - Continuous Drain(Id): 5.8A; RDS(on): 21mΩ@10V; Pd - Power Dissipation: 1.4W; Gate Threshold Voltage (Vgs(th)): 1V@250uA; Gate Charge(Qg): 6.7nC@4.5V; Input Capacitance(Ciss): 550pF; Reverse Transfer Capacitance (Crss@Vds): 48pF; Operating Temperature: -55℃~+150℃; Type: N-Channel; Output Capacitance(Coss): 62pF
R50 = CR0805F827R0G: Type:Thick Film Resistor Resistance:27Ω Tolerance:±1% Tolerance:±1% Power(Watts):125mW Voltage-Supply(Max):150V Temperature Coefficient:±100ppm/℃ Temperature Coefficient:±100ppm/℃ Operating Temperature:-55℃~+125℃ Operating Temperature:-55℃~+125℃; LCSC Part Name: 厚膜电阻 27Ω ±1% 125mW; Supplier Part: C101623; Manufacturer: LIZ(丽智电子); Supplier Footprint: 0805; JLCPCB Part Class: Extended Part; Datasheet: https://item.szlcsc.com/datasheet/CR0805F827R0G/102838.html; Supplier: LCSC; Type: Thick Film Resistor; Tolerance: ±1%; Power(Watts): 125mW; Voltage-Supply(Max): 150V; Temperature Coefficient: ±100ppm/℃; Operating Temperature: -55℃~+125℃
C19 = HCH0603B105K050T: Capacitance:1uF Voltage Rating:50V Temperature Coefficient:X5R; LCSC Part Name: 1uF 50V; Supplier Part: C915830; Manufacturer: IHHEC(禾伸堂); Supplier Footprint: 0603; JLCPCB Part Class: Extended Part; Supplier: LCSC; Voltage Rating: 50V; Temperature Coefficient: X5R
FPC1 = FH34SRJ-22S-0.5SH(50): Locking Feature:- Contact Type:Bottom Contact Number of Contacts:22P Pitch:0.5mm Mounting Type:Horizontal attachment FFC, FCB Thickness:0.3mm FFC, FCB Thickness:0.3mm Height Above Board:1mm Contact Material:Phosphor Bronze Contact Plating:Gold Operating T; LCSC Part Name: 间距:0.5mm P数:22P 下接; Supplier Part: C2889325; Manufacturer: HRS(广濑); Supplier Footprint: SMD,P=0.5mm,卧贴; JLCPCB Part Class: Extended Part; Datasheet: https://atta.szlcsc.com/upload/public/pdf/source/20210903/F493DA4F8E43C57734DEE75CD24FFA7F.pdf; Supplier: LCSC; Contact Type: Bottom Contact; Number of Contacts: 22P; Pitch: 0.5mm; Mounting Type: Horizontal attachment; FFC, FCB Thickness: 0.3mm; Height Above Board: 1mm; Contact Material: Phosphor Bronze; Contact Plating: Gold; Operating Temperature Range: -55℃~+105℃
FPC2 = FH34SRJ-10S-0.5SH(50): Locking Feature:- Contact Type:Double-Sided Contacts, Top and Bottom Entry Number of Contacts:10P Pitch:0.5mm Mounting Type:Surface Mount, Right Angle FFC, FCB Thickness:0.3mm FFC, FCB Thickness:0.3mm Height Above Board:1mm Contact Material:Phosphor Bronz; LCSC Part Name: 间距:0.5mm P数:10P 双侧触点/上下接; Supplier Part: C324723; Manufacturer: HRS(广濑); Supplier Footprint: SMD,P=0.5mm,卧贴; JLCPCB Part Class: Extended Part; Datasheet: https://item.szlcsc.com/datasheet/FH34SRJ-10S-0.5SH(50)/305533.html; Supplier: LCSC; Contact Type: Double-Sided Contacts, Top and Bottom Entry; Number of Contacts: 10P; Pitch: 0.5mm; Mounting Type: Surface Mount, Right Angle; FFC, FCB Thickness: 0.3mm; Height Above Board: 1mm; Contact Material: Phosphor Bronze; Contact Plating: Gold; Operating Temperature: -55℃~+105℃
R22 R23 = RMC04022.2K1%N: Type:Thick Film Resistor Resistance:2.2kΩ Tolerance:±1% Tolerance:±1% Power(Watts):62.5mW Voltage-Supply(Max):50V Temperature Coefficient:±100ppm/℃ Temperature Coefficient:±100ppm/℃ Operating Temperature:-55℃~+155℃ Operating Temperature:-55℃~+155℃; LCSC Part Name: 厚膜电阻 2.2kΩ ±1% 62.5mW; Supplier Part: C325418; Manufacturer: Tyohm(幸亚电阻); Supplier Footprint: 0402; JLCPCB Part Class: Extended Part; Datasheet: https://item.szlcsc.com/datasheet/RMC04022.2K1%2525N/305723.html; Supplier: LCSC; Type: Thick Film Resistor; Tolerance: ±1%; Power(Watts): 62.5mW; Voltage-Supply(Max): 50V; Temperature Coefficient: ±100ppm/℃; Operating Temperature: -55℃~+155℃
U8 = AT42QT2120-SUR: Number of Channels:12 Chip Function:Capacitive Touch Voltage - Supply:1.8V~5.5V Voltage - Supply:1.8V~5.5V; LCSC Part Name: 650V GaN-on-Silicon 增强模式功率晶体管; Supplier Part: C614938; Manufacturer: MICROCHIP(美国微芯); Supplier Footprint: SOIC-20-300mil; JLCPCB Part Class: Extended Part; Datasheet: https://item.szlcsc.com/datasheet/AT42QT2120-SUR/644946.html; Supplier: LCSC; Number of Channels: 12; Chip Function: Capacitive Touch; Voltage - Supply: 1.8V~5.5V
U10 = DRV2605LDGSR: Technology:Yes Number of H-bridges:1 Output Current:- Output Current:- Peak Current:- Voltage - Supply:2V~5.2V Voltage - Supply:2V~5.2V Interface:I2C RDS(on):- Quiescent Current(Iq):500uA Operating Temperature:-40℃~+85℃ Operating Temperature:-40℃~+85℃; LCSC Part Name: 5.5V电机驱动芯片; Supplier Part: C527464; Manufacturer: TI(德州仪器); Supplier Footprint: VSSOP-10-0.5mm; JLCPCB Part Class: Extended Part; Datasheet: https://www.ti.com/cn/lit/gpn/drv2605l; Supplier: LCSC; Technology: Yes; Number of H-bridges: 1; Voltage - Supply: 2V~5.2V; Interface: I2C; Quiescent Current(Iq): 500uA; Operating Temperature: -40℃~+85℃
C31 C32 C34 C35 = CL10B104KB8NNNC: Capacitance:100nF Tolerance:±10% Tolerance:±10% Voltage Rating:50V Temperature Coefficient:X7R; LCSC Part Name: 100nF ±10% 50V; Supplier Part: C1591; Manufacturer: SAMSUNG(三星); Supplier Footprint: 0603; JLCPCB Part Class: Extended Part; Datasheet: https://item.szlcsc.com/datasheet/CL10B104KB8NNNC/1943.html; Supplier: LCSC; Tolerance: ±10%; Voltage Rating: 50V; Temperature Coefficient: X7R
CN4 = PJ-320D_C431535: Connector Type:3.5mm Headphone Jack Current Rating:1A Voltage Rating (Max):12V Contact Material:Copper Contact Plating:Gold Operating Temperature:-30℃~+70℃ Operating Temperature:-30℃~+70℃; LCSC Part Name: 3.5mm耳机座; Supplier Part: C431535; Manufacturer: SHOU HAN(首韩); Supplier Footprint: SMD; JLCPCB Part Class: Extended Part; Datasheet: https://item.szlcsc.com/datasheet/PJ-320D/427892.html; Supplier: LCSC; Connector Type: 3.5mm Headphone Jack; Current Rating: 1A; Voltage Rating (Max): 12V; Contact Material: Copper; Contact Plating: Gold; Operating Temperature: -30℃~+70℃
R42 R46 = 0603WAF330JT5E: Type:Thick Film Resistor Resistance:33Ω Tolerance:±1% Tolerance:±1% Power(Watts):100mW Voltage-Supply(Max):75V Temperature Coefficient:±100ppm/℃ Temperature Coefficient:±100ppm/℃ Operating Temperature:-55℃~+155℃ Operating Temperature:-55℃~+155℃; LCSC Part Name: 33Ω ±1% 100mW 厚膜电阻; Supplier Part: C23140; Manufacturer: UNI-ROYAL(厚声); Supplier Footprint: 0603; JLCPCB Part Class: Basic Part; Datasheet: https://item.szlcsc.com/datasheet/0603WAF330JT5E/23867.html; Supplier: LCSC; Type: Thick Film Resistor; Tolerance: ±1%; Power(Watts): 100mW; Voltage-Supply(Max): 75V; Temperature Coefficient: ±100ppm/℃; Operating Temperature: -55℃~+155℃
R43 R48 = 0603WAF100JT5E: Type:Thick Film Resistor Resistance:10Ω Tolerance:±1% Tolerance:±1% Power(Watts):100mW Voltage-Supply(Max):75V Temperature Coefficient:±400ppm/℃ Temperature Coefficient:±400ppm/℃ Operating Temperature:-55℃~+155℃ Operating Temperature:-55℃~+155℃; LCSC Part Name: 10Ω ±1% 100mW 厚膜电阻; Supplier Part: C22859; Manufacturer: UNI-ROYAL(厚声); Supplier Footprint: 0603; JLCPCB Part Class: Basic Part; Datasheet: https://item.szlcsc.com/datasheet/0603WAF100JT5E/23586.html; Supplier: LCSC; Type: Thick Film Resistor; Tolerance: ±1%; Power(Watts): 100mW; Voltage-Supply(Max): 75V; Temperature Coefficient: ±400ppm/℃; Operating Temperature: -55℃~+155℃
R44 R45 R47 R49 = RC0603FR-07100KL: Type:Thick Film Resistors Resistance: Tolerance:±1% Tolerance:±1% Power(Watts): Overload Voltage (Max): Temperature Coefficient:±100ppm/℃ Temperature Coefficient:±100ppm/℃ Operating Temperature Range:-55℃~+155℃ Operating Temperature Range:-55℃~+155℃; LCSC Part Name: 厚膜电阻 100kΩ ±1% 100mW; Supplier Part: C14675; Manufacturer: YAGEO(国巨); Supplier Footprint: 0603; JLCPCB Part Class: Extended Part; Datasheet: https://atta.szlcsc.com/upload/public/pdf/source/20140324/1457707028752.pdf; Supplier: LCSC; Type: Thick Film Resistors; Tolerance: ±1%; Temperature Coefficient: ±100ppm/℃; Operating Temperature Range: -55℃~+155℃
U14 U15 = RVT1C100M0405 10UF 16V: Capacitance:10uF Tolerance:±20% Tolerance:±20% Voltage Rating:16V Ripple Current:15mA@120Hz Equivalent Series Resistance(ESR):- Diameter:4mm Height - Seated (Max):5.4mm Lifetime:2800hrs@105℃ Operating Temperature:-55℃~+105℃ Operating Temperature:-55℃~+105; LCSC Part Name: 10uF ±20% 16V; Supplier Part: C970654; Manufacturer: DMBJ(振宝佳); Supplier Footprint: SMD,D4xL5.4mm; JLCPCB Part Class: Extended Part; Datasheet: https://item.szlcsc.com/datasheet/RVT1C100M0405%252010UF%252016V/1060382.html; Supplier: LCSC; Tolerance: ±20%; Voltage Rating: 16V; Ripple Current: 15mA@120Hz; Diameter: 4mm; Height - Seated (Max): 5.4mm; Lifetime: 2800hrs@105℃; Operating Temperature: -55℃~+105℃
U16 = OPA1642AIDR: Class:- Speaker Channels:2-Channel Output Power:- Total Harmonic Distortion + Noise (THD+N):0.00005% Quiescent Current:1.8mA Signal-to-Noise Ratio:- Power Supply Rejection Ratio (PSRR):- Efficiency:- Number of Inputs:2 Pairs Differential Inputs Features:-; LCSC Part Name: OPA164x 声加高性能、结型场效应晶体管输入音频运算放大器; Supplier Part: C67640; Manufacturer: TI(德州仪器); Supplier Footprint: SOIC-8; JLCPCB Part Class: Extended Part; Datasheet: https://www.ti.com/cn/lit/gpn/opa1642; Supplier: LCSC; Speaker Channels: 2-Channel; Total Harmonic Distortion + Noise (THD+N): 0.00005%; Quiescent Current: 1.8mA; Number of Inputs: 2 Pairs Differential Inputs; Voltage - Supply: 2.25V~18V；-18V~-2.25V; Operating Temperature: -40℃~+85℃

## Nets
+3V3_DIGITAL: C13.1 CARD1.4(VDD) CN3.7 CN3.8 CN3.40 CN3.41 CN3.42 R16.2 R17.2 R18.2 R19.2 R20.2 R21.1 R22.1 R23.2 R24.1 R40.1 R41.1 U5.5(VOUT) U7.2 U8.11(VDD) U9.2 U10.5(EN) U10.10(VDD) U11.1 U12.3(VDD) U12.4(VDD)
+4V5_ANALOG: C17.1 C32.1 C33.1 R12.1 U6.11(OUT+) U16.8(V+)
+5V: C14.2 C20.1 C21.1 C23.1 C25.2 C28.2 C29.2 L3.1 L4.1 L5.1 R50.1 R53.1 U2.4(VOUT) U2.5(VOUT) U5.3(EN) U6.8(EN–) U6.12(EN+)
-4V5_ANALOG: C18.2 C30.2 C31.2 R14.1 U6.6(OUT–) U16.4(V-)
AGND: C1.1 C2.1 C3.1 C7.2 C11.1 C12.2 C13.2 C14.1 C16.1 C17.2 C18.1 C19.1 C20.2 C21.2 C22.1 C23.2 C24.2 C25.1 C26.2 C27.1 C28.1 C30.1 C31.1 C32.2 C33.2 C34.2 C35.2 CARD1.6(VSS) CARD1.10 CARD1.11 CARD1.12 CARD1.13 CN1.3 CN3.6 CN3.9 CN3.11 CN3.12 CN3.13 CN3.14 CN3.15 CN3.16 CN3.17 CN3.18 CN3.19 CN3.20 CN3.21 CN3.22 CN3.23 CN3.24 CN3.25 CN3.26 CN3.27 CN3.28 CN3.29 CN3.30 CN3.31 CN3.32 CN3.35 CN3.43 CN3.48 CN3.49 CN3.50 CN3.51 CN3.52 CN4.2 FPC1.1 FPC1.3 FPC1.5 FPC1.7 FPC1.12 FPC1.13 FPC1.14 FPC1.17 FPC1.18 FPC1.19 FPC1.20 FPC1.21 FPC1.22 FPC1.23 FPC1.24 FPC2.1 FPC2.3 FPC2.5 FPC2.7 FPC2.9 FPC2.11 FPC2.12 Q1.2(S) R1.1 R2.1 R3.1 R10.2 R13.2 R15.1 R44.1 R45.1 R47.1 R49.1 R52.1 R54.2 U1.4(#CE) U1.6(EN1) U1.8(VSS) U1.15(SYSOFF) U1.17(EP) U2.2(GND) U2.15(PGND) U4.20(AGND) U4.40(DGND) U5.2(GND) U6.1(PGOOD) U6.4(GND) U6.13(EP) U7.1 U8.10(VSS) U8.12(MODE) U9.1 U10.4(IN/TRIG) U10.8(GND) U11.2 U12.8(GND) U12.9(GND) U12.15(EP) USB1.1(EP) USB1.2(EP) USB1.3(EP) USB1.4(EP) USB1.A1(GND) USB1.A12(GND) USB1.B1(GND) USB1.B12(GND)
VBAT: C22.2 CN1.1 U1.2(BAT) U1.3(BAT)
VBUS: C7.1 R51.1 U1.13(IN) U12.2(VBUS) USB1.A4(VBUS) USB1.A9(VBUS) USB1.B4(VBUS) USB1.B9(VBUS)
AUDIO_L: U4.18(AUDIO_OUT_1) U14.1
AUDIO_R: U4.19(AUDIO_OUT_2) U15.1
BTN_E: FPC1.10 U4.30(D23)
BTN_N: FPC1.8 U4.28(D21)
BTN_S: FPC1.9 U4.29(D22)
BTN_W: FPC1.11 U4.31(D24)
CC1: U12.10(CC1) U12.11(CC1) USB1.A5(CC1)
CC2: U12.1(CC2) U12.14(CC2) USB1.B5(CC2)
CLX: CARD1.5(CLX) U4.7(D6)
CMD: CARD1.3(CMD) R18.1 U4.6(D5)
DAT0: CARD1.7(DAT0) R19.1 U4.5(D4)
DAT1: CARD1.8(DAT1) R20.1 U4.4(D3)
DAT2: CARD1.1(DAT2) R16.1 U4.3(D2)
DAT3: CARD1.2(CD/DAT3) R17.1 U4.2(D1)
DISP_CS: CN3.38 U4.8(D7)
DISP_DC: CN3.36 U4.14(D13)
DISP_PWM: Q1.1(G) U4.27(D20)
DISP_RST: CN3.10 U4.15(D14)
FUSB_INT: U4.32(D25) U12.5(INT_N)
GPIO_OFF: R11.2 U4.26(D19)
GPIO_ON: D2.2(A) U4.25(D18)
HAP_N: FPC1.16 U10.9(OUT-)
HAP_P: FPC1.15 U10.7(OUT+)
NTC: CN1.2 U1.1(TS)
SCL: R23.1 R41.2 U4.12(D11) U8.16(SCL) U10.2(SCL) U12.6(SCL)
SD_CD: CARD1.CD R21.2 U4.22(D15)
SDA: R22.2 R40.2 U4.13(D12) U8.13(SDA) U10.3(SDA) U12.7(SDA)
SNS0: FPC1.2 R25.2
SNS1: FPC1.4 R26.2
SNS2: FPC1.6 R27.2
SNS3: FPC2.2 R28.2
SNS4: FPC2.4 R29.2
SNS5: FPC2.6 R30.2
SNS6: FPC2.8 R31.2
SNS7: FPC2.10 R32.2
SPI_MOSI: CN3.34 U4.11(D10)
SPI_SCK: CN3.37 U4.9(D8)
TOUCH_CHANGE: R24.2 U4.23(D16) U8.17(CHANGE#)
TOUCH_RESET: U4.24(D17) U8.14(RESET#)
USB_D+: U4.37(D30) USB1.A6(DP1) USB1.B6(DP2)
USB_D-: U4.36(D29) USB1.A7(DN1) USB1.B7(DN2)
VSYS: C1.2 C2.2 C3.2 C11.2 CN2.1 U1.10(OUT) U1.11(OUT) U2.1(VINA) U2.10(VIN) U2.11(VIN) U2.13(PS/SYNC)
$1N2216: R1.2 U1.16(ISET)
$1N2243: R2.2 U1.12(ILIM)
$1N2252: R3.2 U1.14(TMR)
$1N2345: R51.2 R52.2 U1.5(EN2)
$1N3188: L2.2 U2.8(L1) U2.9(L1)
$1N3192: L2.1 U2.6(L2) U2.7(L2)
$1N3331: C29.1 R53.2 R54.1 U2.3(FB)
$1N5284: CN2.2 D2.1(K) R10.1 R11.1 U2.12(EN)
$1N7346: C12.1 C26.1 L4.2 U5.1(VIN)
$1N7688: C15.2 U6.10(C1+)
$1N7694: C15.1 U6.9(C1–)
$1N7763: C16.2 U6.5(CP)
$1N7997: R12.2 R13.1 U6.2(FB+)
$1N8179: R14.2 R15.2 U6.7(FB–)
$1N9576: C27.2 L5.2 U6.3(VIN)
$3N2452: C24.1 L3.2 U4.39(VIN)
$4N1113: CN3.2 CN3.3 CN3.4 CN3.5 Q1.3(D)
$4N1278: CN3.1 R50.2
$5N2187: R32.1 U8.2(KEY7/GPO5)
$5N2192: R31.1 U8.3(KEY6/GPO4)
$5N2197: R30.1 U8.4(KEY5/GP03)
$5N2202: R29.1 U8.5(KEY4/GPO2)
$5N2207: R28.1 U8.6(KEY3/GPO1)
$5N2212: R27.1 U8.7(KEY2/GPO0)
$5N2217: R26.1 U8.8(KEY1)
$5N2222: R25.1 U8.9(KEY0)
$5N2566: C19.2 U10.1(REG)
$6N1003: R45.2 U14.2 U16.3(INA+)
$6N1101: R46.1 U16.1(OUTA) U16.2(INA-)
$6N1331: R44.2 U15.2 U16.5(INB+)
$6N1353: R42.1 U16.6(INB-) U16.7(OUTB)
$6N1376: CN4.4 R43.1 R46.2 R47.2
$6N1422: CN4.3 R42.2 R48.1 R49.2
$6N1437: C34.1 R43.2
$6N1693: C35.1 R48.2

Not connected (* = marked no-connect by the designer): CN3 33* 39* 44* 45* 46* 47*; CN4 1*; U1 7(#PGOOD)* 9(#CHG)*; U2 14(PG)*; U4 1(D0)* 10(D9)* 16(AUDIO_IN_1)* 17(AUDIO_IN_2)* 21(3V3_A)* 33(D26)* 34(D27)* 35(D28)* 38(3V3_D)*; U5 4(NC)*; U8 1(KEY8/GPO6)* 15(N/C)* 18(KEY11/GPO9)* 19(KEY10/GPO8)* 20(KEY9/GPO7)*; U10 6(VDD/NC)*; U12 12(VCONN)* 13(VCONN)*; USB1 A8(SBU1)* B8(SBU2)*

## Notes on the sheets
sheet 1
- Li-Ion Charger & Power Path
- USB-C Input and Protection
- Battery Interface
- +5V Buck-Boost Converter
- ±4.5V Audio Supply
- +3.3V Digital LDO
